# EAGLE design pogo_adapter_board_v1_1 (EAGLE 6.4)
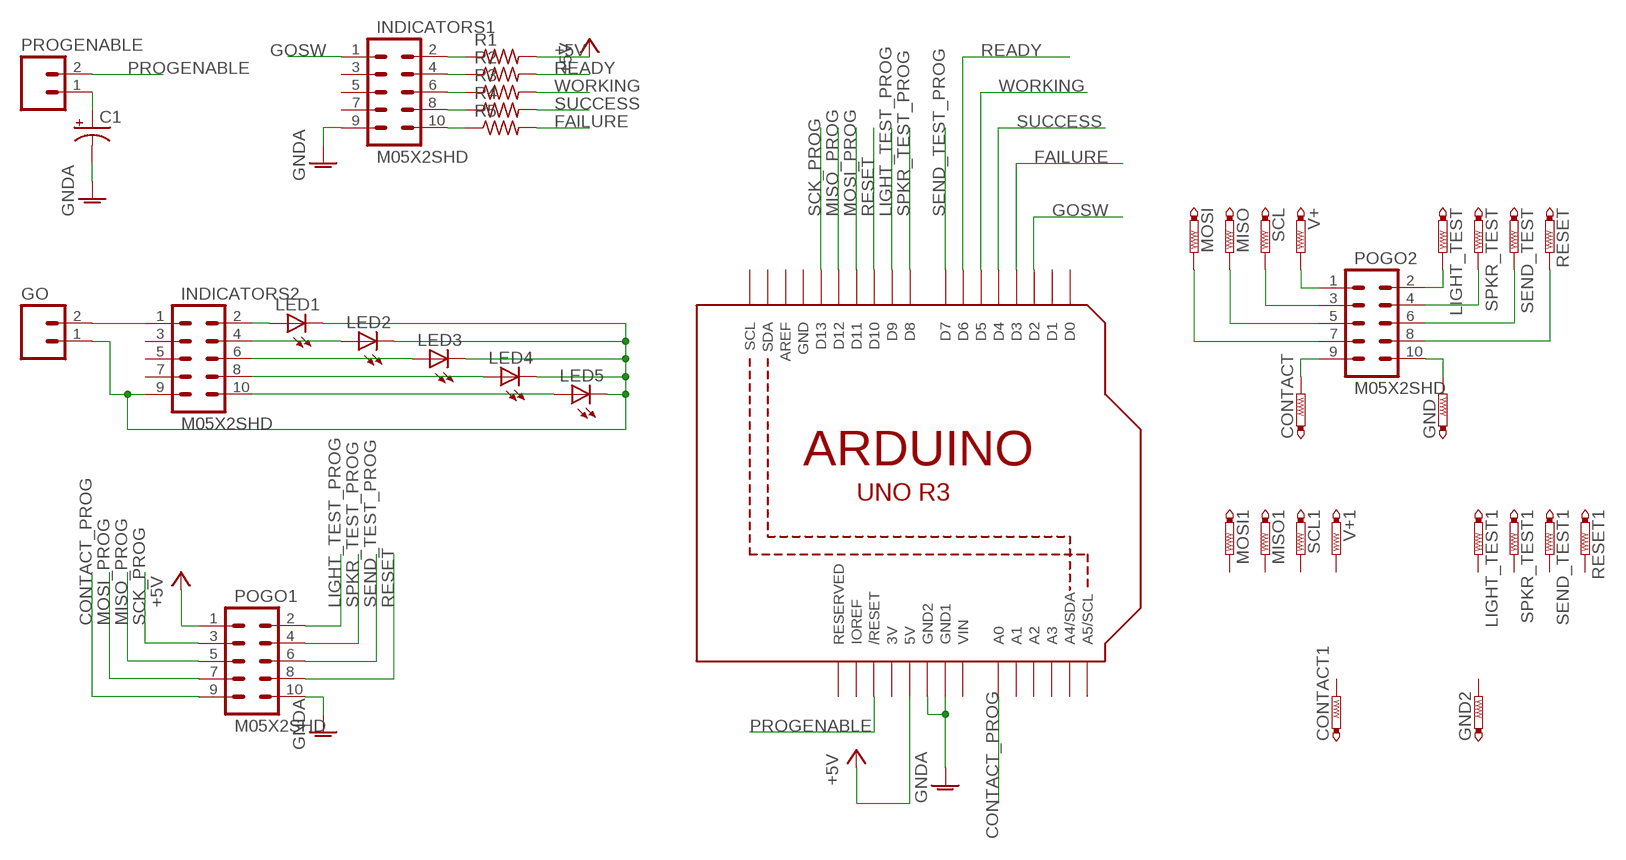
[diagram p0: schematic, sheet 1]

## Parts
C1  CAP_POLPTH2  [CPOL-RADIAL-10UF-25V]
CONTACT  PTR1PAD1-13  [P1-13]
CONTACT1  PTR1PAD1-13  [P1-13]
GND  PTR1PAD1-13  [P1-13]
GND2  PTR1PAD1-13  [P1-13]
GO  M02-JST-2-PTH-NO_SILK  [JST-2-PTH-NS]
INDICATORS1  M05X2SHD  [2X5-SHROUDED]
INDICATORS2  M05X2SHD  [2X5-SHROUDED]
LED1  LED10MM  [LED10MM]
LED2  LED10MM  [LED10MM]
LED3  LED10MM  [LED10MM]
LED4  LED10MM  [LED10MM]
LED5  LED10MM  [LED10MM]
LIGHT_TEST  PTR1PAD1-13  [P1-13]
LIGHT_TEST1  PTR1PAD1-13  [P1-13]
MISO  PTR1PAD1-13  [P1-13]
MISO1  PTR1PAD1-13  [P1-13]
MOSI  PTR1PAD1-13  [P1-13]
MOSI1  PTR1PAD1-13  [P1-13]
POGO1  M05X2SHD  [2X5-SHROUDED]
POGO2  M05X2SHD  [2X5-SHROUDED]
PROGENABLE  M02-JST-2-PTH-NO_SILK  [JST-2-PTH-NS]
R1  R-US_0204/7  [0204/7]
R2  R-US_0204/7  [0204/7]
R3  R-US_0204/7  [0204/7]
R4  R-US_0204/7  [0204/7]
R5  R-US_0204/7  [0204/7]
RESET  PTR1PAD1-13  [P1-13]
RESET1  PTR1PAD1-13  [P1-13]
SCL  PTR1PAD1-13  [P1-13]
SCL1  PTR1PAD1-13  [P1-13]
SEND_TEST  PTR1PAD1-13  [P1-13]
SEND_TEST1  PTR1PAD1-13  [P1-13]
SPKR_TEST  PTR1PAD1-13  [P1-13]
SPKR_TEST1  PTR1PAD1-13  [P1-13]
U1  ARDUINOR3  [ARDUINOR3-MINSHIELD]
V+  PTR1PAD1-13  [P1-13]
V+1  PTR1PAD1-13  [P1-13]

## Nets
+5V: POGO1.1 R1.2 U1.5V
CONTACT_PROG: POGO1.9 U1.A0
FAILURE: R5.2 U1.D3
GNDA: C1.2(-) INDICATORS1.9 POGO1.10 U1.GND1 U1.GND2
GOSW: INDICATORS1.1 U1.D2
LIGHT_TEST_PROG: POGO1.2 U1.D9
MISO_PROG: POGO1.5 U1.D12
MOSI_PROG: POGO1.7 U1.D11
N$1: LIGHT_TEST.TP POGO2.2
N$2: POGO2.4 SPKR_TEST.TP
N$3: POGO2.6 SEND_TEST.TP
N$4: POGO2.8 RESET.TP
N$5: GND.TP POGO2.10
N$6: GO.2 INDICATORS2.1
N$7: CONTACT.TP POGO2.9
N$8: POGO2.3 SCL.TP
N$9: MISO.TP POGO2.5
N$10: MOSI.TP POGO2.7
N$11: POGO2.1 V+.TP
N$12: C1.1(+) PROGENABLE.1
N$13: INDICATORS2.2 LED1.A
N$14: INDICATORS2.4 LED2.A
N$15: INDICATORS2.6 LED3.A
N$16: INDICATORS2.8 LED4.A
N$17: INDICATORS2.10 LED5.A
N$18: INDICATORS1.2 R1.1
N$19: INDICATORS1.4 R2.1
N$20: INDICATORS1.6 R3.1
N$21: INDICATORS1.8 R4.1
N$22: INDICATORS1.10 R5.1
N$23: GO.1 INDICATORS2.9 LED1.K(C) LED2.K(C) LED3.K(C) LED4.K(C) LED5.K(C)
PROGENABLE: PROGENABLE.2 U1.RESET(/RESET)
READY: R2.2 U1.D6
RESET: POGO1.8 U1.D10
SCK_PROG: POGO1.3 U1.D13
SEND_TEST_PROG: POGO1.6 U1.D7
SPKR_TEST_PROG: POGO1.4 U1.D8
SUCCESS: R4.2 U1.D4
WORKING: R3.2 U1.D5
Unconnected: CONTACT1.TP GND2.TP INDICATORS1.3 INDICATORS1.5 INDICATORS1.7 INDICATORS2.3 INDICATORS2.5 INDICATORS2.7 LIGHT_TEST1.TP MISO1.TP MOSI1.TP RESET1.TP SCL1.TP SEND_TEST1.TP SPKR_TEST1.TP U1.A1 U1.A2 U1.A3 U1.A4(A4/SDA) U1.A5(A5/SCL) U1.AREF U1.D0 U1.D1 U1.IOREF U1.RESERVED U1.SCL U1.SDA V+1.TP

## Power pins joined to a net without a drawn wire
3V: U1.3V
GND: U1.GND
VIN: U1.VIN

## Library data of the parts
C1 = SparkFun:CAP_POL: Capacitor Polarized These are standard SMD and PTH capacitors. Normally 10uF, 47uF, and 100uF in electrolytic and tantalum varieties. Always verify the external diameter of the through hole cap, it varies with capacity, voltage, and manufacturer. The EIA devices should be standard.
CONTACT CONTACT1 GND GND2 LIGHT_TEST LIGHT_TEST1 MISO MISO1 MOSI MOSI1 RESET RESET1 SCL SCL1 SEND_TEST SEND_TEST1 SPKR_TEST SPKR_TEST1 V+ V+1 = testpad:PTR1: TEST PIN
GO PROGENABLE = SparkFun:M02: Header 2 Standard 2-pin 0.1" header. Use with straight break away headers (SKU : PRT-00116), right angle break away headers (PRT-00553), swiss pins (PRT-00743), machine pins (PRT-00117), and female headers (PRT-00115). Molex polarized connector foot print use with SKU : PRT-08233 with associated crimp pins and housings.
INDICATORS1 INDICATORS2 POGO1 POGO2 = SparkFun:M05X2: Header 5x2 Standard 10-pin dual row 0.1" header. Commonly used with AVR-ISP. Use with Spark Fun Electronics SKU: PRT-00778
LED1-LED5 = led:LED: LED OSRAM: - CHIPLED LG R971, LG N971, LY N971, LG Q971, LY Q971, LO R971, LY R971 LH N974, LH R974 LS Q976, LO Q976, LY Q976 LO Q996 - Hyper CHIPLED LW Q18S LB Q993, LB Q99A, LB R99A - SideLED LS A670, LO A670, LY A670, LG A670, LP A670 LB A673, LV A673, LT A673, LW A673 LH A674 LY A675 LS A676, LA A676, LO A676, LY A676, LW A676 LS A679, LY A679, LG A679 - Hyper Micro SIDELED® LS Y876, LA Y876, LO Y876, LY Y876 LT Y87S - SmartLED LW L88C, LW L88S LB L89C, LB L89S, LG L890 LS L89K, LO L89K, LY L89K LS L896, LA L896, LO L896, LY L896 - TOPLED LS T670, LO T670, LY T670, LG T670, LP T670 LSG T670, LSP T670, LSY T670, LOP T670, LYG T670 LG T671, LOG T671, LSG T671 LB T673, LV T673, LT T673, LW T673 LH T674 LS T676, LA T676, LO T676, LY T676, LB T676, LH T676, LSB T676, LW T676 LB T67C, LV T67C, LT T67C, LS T67K, LO T67K, LY T67K, LW E67C LS E67B, LA E67B, LO E67B, LY E67B, LB E67C, LV E67C, LT E67C LW T67C LS T679, LY T679, LG T679 LS T770, LO T770, LY T770, LG T770, LP T770 LB T773, LV T773, LT T773, LW T773 LH T774 LS E675, LA E675, LY E675, LS T675 LS T776, LA T776, LO T776, LY T776, LB T776 LHGB T686 LT T68C, LB T68C - Hyper Mini TOPLED® LB M676 - Mini TOPLED Santana® LG M470 LS M47K, LO M47K, LY M47K Source: http://www.osram.convergy.de LUXEON: - LUMILED® LXK2-PW12-R00, LXK2-PW12-S00, LXK2-PW14-U00, LXK2-PW14-V00 LXK2-PM12-R00, LXK2-PM12-S00, LXK2-PM14-U00 LXK2-PE12-Q00, LXK2-PE12-R00, LXK2-PE12-S00, LXK2-PE14-T00, LXK2-PE14-U00 LXK2-PB12-K00, LXK2-PB12-L00, LXK2-PB12-M00, LXK2-PB14-N00, LXK2-PB14-P00, LXK2-PB14-Q00 LXK2-PR12-L00, LXK2-PR12-M00, LXK2-PR14-Q00, LXK2-PR14-R00 LXK2-PD12-Q00, LXK2-PD12-R00, LXK2-PD12-S00 LXK2-PH12-R00, LXK2-PH12-S00 LXK2-PL12-P00, LXK2-PL12-Q00, LXK2-PL12-R00 Source: www.luxeon.com KINGBRIGHT: KA-3528ASYC Source: www.kingbright.com
R1-R5 = rcl:R-US_: RESISTOR, American symbol
U1 = adafruit:ARDUINOR3: This is a new object for the new Arduino R3 - with extra pins that you may want to use (such as IOref, and duplicated A4/A5

## Board
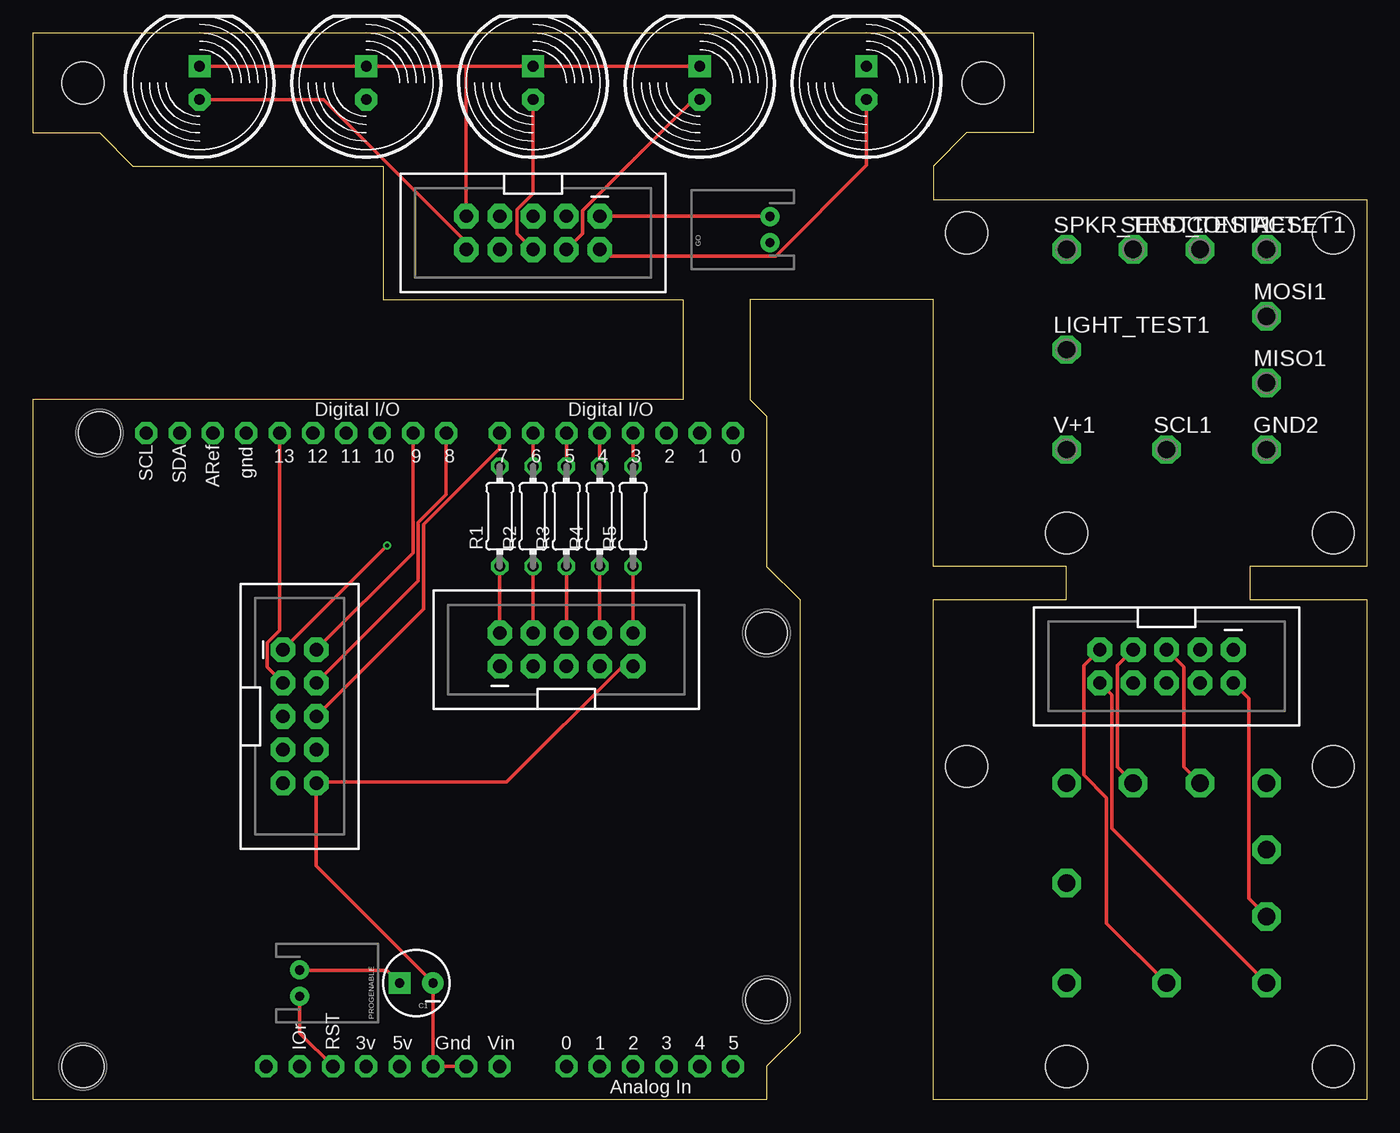
[diagram p1: board, top side]
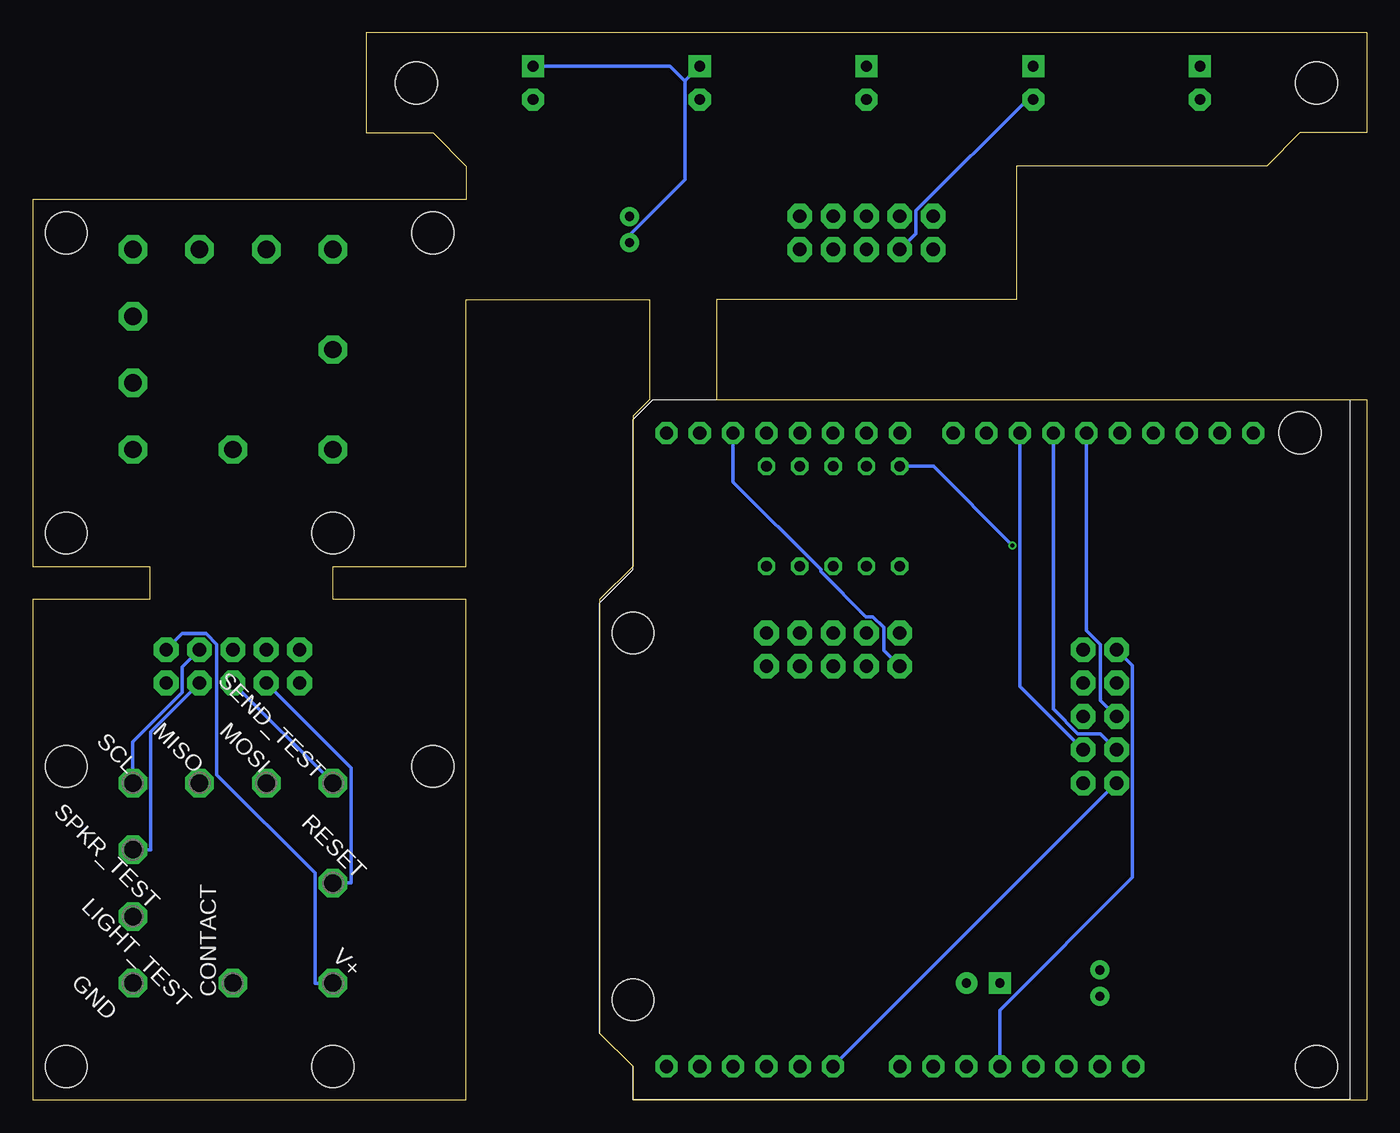
[diagram p2: board, bottom side, seen from below]

Size 101.6 x 81.28 mm. Coordinates in mm from the lower left corner, seen from the top.
Outline: 0,81.28 0,73.66 5.08,73.66 7.62,71.12 26.67,71.12 26.67,60.96 49.53,60.96 49.53,53.34 0,53.34 0,0 55.88,0 55.88,2.54 58.42,5.08 58.42,38.1 55.88,40.64 55.88,52.07 54.61,53.34 54.61,60.96 68.58,60.96 68.58,40.64 78.74,40.64 78.74,38.1 68.58,38.1 68.58,0 101.6,0 101.6,38.1 92.71,38.1 92.71,40.64 101.6,40.64 101.6,68.58 68.58,68.58 68.58,71.12 71.12,73.66 76.2,73.66 76.2,81.28 0,81.28
Copper layers (1*16): Top 0.035mm / dielectric 1.5mm / Bottom 0.035mm
Design rules "Fusion_eagle_rule_v1.1 *": minimum track width 10mil, minimum drill 12mil, track to track 6mil, track to pad 6mil, pad to pad 6mil, via to via 6mil, smd to smd 0mil, copper to edge 10mil, drill to drill 10mil, minimum pad ring 10mil, minimum via ring 6mil, stop-mask expansion 2mil, vias tented up to drill 100mil, thermal gap 10mil
Holes 3.2 mm at 3.81,77.47 72.39,77.47 99.06,2.54 78.74,2.54 71.12,25.4 99.06,25.4 99.06,43.18 78.74,43.18 99.06,66.04 71.12,66.04 5.08,50.8 3.81,2.54 55.88,7.62 55.88,35.56

### Footprints (pad centres in the part's own frame; a part is rotated, then mirrored left to right if it is on the bottom)
CPOL-RADIAL-10UF-25V = drill 0.7 pad 1.651 square: 1 1.27,0 | drill 0.7 pad 1.651: 2 -1.27,0
P1-13 = drill 1.321 pad 2.159 octagon: TP 0,0
JST-2-PTH-NS = drill 0.7 pad 1.448: 1 -1,0; 2 1,0
2X5-SHROUDED = drill 1.016 pad 1.88 octagon: 1 -1.27,5.08; 2 1.27,5.08; 3 -1.27,2.54; 4 1.27,2.54; 5 -1.27,0; 6 1.27,0; 7 -1.27,-2.54; 8 1.27,-2.54; 9 -1.27,-5.08; 10 1.27,-5.08
LED10MM = drill 0.813 pad 1.676 octagon: A -1.27,0 | drill 0.813 pad 1.676 square: K 1.27,0
0204/7 = drill 0.813 octagon: 1 -3.81,0; 2 3.81,0
ARDUINOR3-MINSHIELD = drill 1 pad 1.676 octagon: 3V 24.13,2.54; 5V 26.67,2.54; A0 39.37,2.54; A1 41.91,2.54; A2 44.45,2.54; A3 46.99,2.54; A4 49.53,2.54; A5 52.07,2.54; AREF 12.446,50.8; D0 52.07,50.8; D1 49.53,50.8; D2 46.99,50.8; D3 44.45,50.8; D4 41.91,50.8; D5 39.37,50.8; D6 36.83,50.8; D7 34.29,50.8; D8 30.226,50.8; D9 27.686,50.8; D10 25.146,50.8; D11 22.606,50.8; D12 20.066,50.8; D13 17.526,50.8; GND 14.986,50.8; GND1 31.75,2.54; GND2 29.21,2.54; IOREF 19.05,2.54; RESERVED 16.51,2.54; RESET 21.59,2.54; SCL 7.366,50.8; SDA 9.906,50.8; VIN 34.29,2.54

### Placement (x,y rotation side)
C1  29.21,8.89 180 top
CONTACT  86.36,8.89 90 bottom
CONTACT1  88.9,64.77 0 top
GND  93.98,8.89 90 bottom
GND2  93.98,49.53 0 top
GO  56.16,66.29 90 top
INDICATORS1  40.64,34.29 90 top
INDICATORS2  38.1,66.04 270 top
LED1  63.5,77.47 90 top
LED2  50.8,77.47 90 top
LED3  38.1,77.47 90 top
LED4  25.4,77.47 90 top
LED5  12.7,77.47 90 top
LIGHT_TEST  93.98,13.97 90 bottom
LIGHT_TEST1  78.74,57.15 0 top
MISO  88.9,24.13 90 bottom
MISO1  93.98,54.61 0 top
MOSI  83.82,24.13 90 bottom
MOSI1  93.98,59.69 0 top
POGO1  20.32,29.21 0 top
POGO2  86.36,33.02 270 top
PROGENABLE  20.32,8.89 270 top
R1  35.56,44.45 90 top
R2  38.1,44.45 90 top
R3  40.64,44.45 90 top
R4  43.18,44.45 90 top
R5  45.72,44.45 90 top
RESET  78.74,16.51 90 bottom
RESET1  93.98,64.77 0 top
SCL  93.98,24.13 90 bottom
SCL1  86.36,49.53 0 top
SEND_TEST  78.74,24.13 90 bottom
SEND_TEST1  83.82,64.77 0 top
SPKR_TEST  93.98,19.05 90 bottom
SPKR_TEST1  78.74,64.77 0 top
U1  1.27,0 0 top
V+  78.74,8.89 90 bottom
V+1  78.74,49.53 0 top

### Tracks (layer width: path | path; a pad name or v marks a point on that pad's centre or on a via)
+5V  (via drill 0.3)
  Top 0.254: POGO1.1 v27,42.24
  Bottom 0.254: R1.2 33.02,48.26 v27,42.24 | U1.5V 27.94,6.83 17.83,16.94 17.83,33.07 POGO1.1
CONTACT_PROG
  Bottom 0.254: POGO1.9 U1.A0
FAILURE
  Top 0.254: U1.D3 R5.2
GNDA
  Top 0.254: U1.GND1 U1.GND2 C1.2 30.4,8.99 21.59,17.8 POGO1.10 21.69,24.21 36.09,24.21 44.91,33.02 INDICATORS1.9
GOSW
  Bottom 0.254: U1.D2 48.26,47.07 41.58,40.39 41.58,40.23 38.12,36.78 37.59,36.78 36.78,35.97 36.78,34.24 INDICATORS1.1
LIGHT_TEST_PROG
  Top 0.254: U1.D9 28.96,41.66 POGO1.2
MISO_PROG
  Bottom 0.254: U1.D12 21.34,35.76 20.27,34.7 20.27,30.43 POGO1.5
MOSI_PROG
  Bottom 0.254: U1.D11 23.88,29.77 22,27.89 20.27,27.89 POGO1.7
N$1
  Top 0.254: POGO2.2 92.61,30.58 92.61,15.34 LIGHT_TEST.TP
N$2
  Bottom 0.254: POGO2.4 92.61,28.04 92.61,19.05 SPKR_TEST.TP
N$3
  Bottom 0.254: SEND_TEST.TP POGO2.6
N$4
  Bottom 0.254: POGO2.8 77.37,25.3 77.37,16.51 RESET.TP
N$5
  Top 0.254: POGO2.10 82.19,30.84 82.19,20.68 GND.TP
N$6
  Top 0.254: INDICATORS2.1 56.16,67.31 GO.2
N$7
  Top 0.254: POGO2.9 80.06,33.07 80.06,24.74 81.79,23.01 81.79,13.46 CONTACT.TP
N$8
  Bottom 0.254: POGO2.3 90.22,32.97 90.22,31.01 93.98,27.25 SCL.TP
N$9
  Top 0.254: POGO2.5 87.68,32.97 87.68,25.35 MISO.TP
N$10
  Top 0.254: POGO2.7 82.6,33.07 82.6,25.35 MOSI.TP
N$11
  Bottom 0.254: POGO2.1 90.22,35.51 88.39,35.51 87.58,34.7 87.58,24.74 80.11,17.27 80.11,8.89 V+.TP
N$12
  Top 0.254: C1.1 26.95,9.88 PROGENABLE.1
N$13
  Top 0.254: LED1.A 63.5,71.2 56.59,64.29 43.66,64.29 INDICATORS2.2
N$14
  Top 0.254: LED2.A 50.34,76.2 41.86,67.72 41.86,65.99 INDICATORS2.4
N$15
  Top 0.254: LED3.A 38.1,69.04 36.88,67.82 36.88,65.99 INDICATORS2.6
N$16
  Bottom 0.254: LED4.A 25.86,76.2 34.34,67.72 34.34,65.99 INDICATORS2.8
N$17
  Top 0.254: LED5.A 22.15,76.2 33.02,65.33 INDICATORS2.10
N$18
  Top 0.254: INDICATORS1.2 R1.1
N$19
  Top 0.254: INDICATORS1.4 R2.1
N$20
  Top 0.254: INDICATORS1.6 R3.1
N$21
  Top 0.254: INDICATORS1.8 R4.1
N$22
  Top 0.254: INDICATORS1.10 R5.1
N$23
  Top 0.254: LED5.K LED4.K 33.02,78.74 | 33.02,78.74 LED3.K LED2.K | 33.02,78.74 INDICATORS2.9
  Bottom 0.254: GO.1 56.16,65.86 51.92,70.1 51.92,77.62 | LED2.K 51.92,77.62 | LED1.K 53.06,78.74 52.02,77.7 51.92,77.62
PROGENABLE
  Top 0.254: PROGENABLE.2 20.32,5.08 U1.RESET
READY
  Top 0.254: U1.D6 R2.2
RESET
  Bottom 0.254: U1.D10 26.42,31.5 POGO1.8
SCK_PROG
  Top 0.254: U1.D13 18.8,35.76 17.83,34.8 17.83,32.97 POGO1.3
SEND_TEST_PROG
  Top 0.254: U1.D7 35.56,49.61 29.77,43.81 29.77,37.39 POGO1.6
SPKR_TEST_PROG
  Top 0.254: U1.D8 31.5,46.13 29.36,43.99 29.36,39.52 POGO1.4
SUCCESS
  Top 0.254: U1.D4 R4.2
WORKING
  Top 0.254: U1.D5 R3.2